# EAGLE schematic Power_Alert (EAGLE 9.6.2)
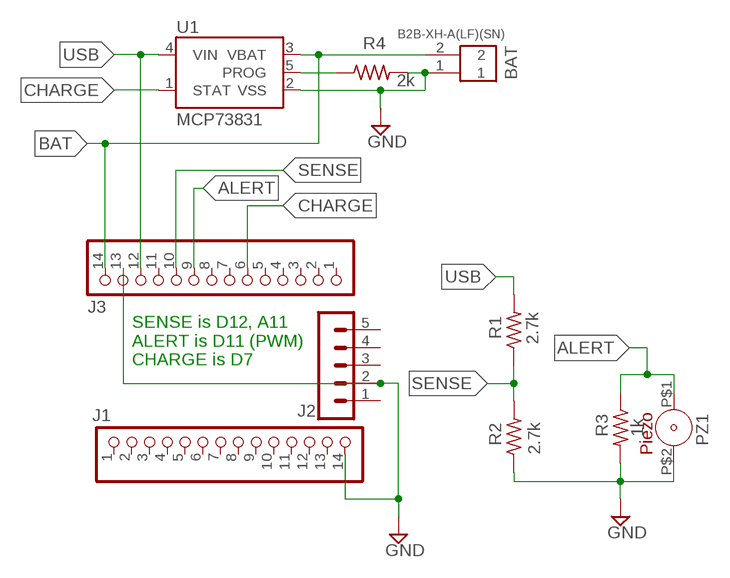
[diagram p0: schematic, sheet 1]

## Parts
BAT  B2B-XH-A(LF)(SN)  [B2B-XH-A(LF)(SN)]
J1  PINHD-1X14  [1X14]
J2  MA05-1  [MA05-1]
J3  PINHD-1X14  [1X14]
PZ1  TDK-PS1420P02CT  [TDK-PS1420P02CT]
R1  2.7k  R-US_R1206  [R1206]
R2  2.7k  R-US_R1206  [R1206]
R3  1k  R-US_R1206  [R1206]
R4  2k  R-US_M1206  [M1206]
U1  MCP73831  [SOT23-5]

## Nets
ALERT: J3.9 PZ1.P$1 R3.1
BAT: BAT.2 J3.14 U1.3(VBAT)
CHARGE: J3.6 U1.1(STAT)
GND: BAT.1 J1.14 J2.2 J3.13 PZ1.P$2 R2.1 R3.2 R4.2 U1.2(VSS)
N$1: R4.1 U1.5(PROG)
SENSE: J3.10 R1.1 R2.2
USB: J3.12 R1.2 U1.4(VIN)
Unconnected: J1.1 J1.2 J1.3 J1.4 J1.5 J1.6 J1.7 J1.8 J1.9 J1.10 J1.11 J1.12 J1.13 J2.1 J2.3 J2.4 J2.5 J3.1 J3.2 J3.3 J3.4 J3.5 J3.7 J3.8 J3.11

## Notes on the sheet
- SENSE is D12, A11
  ALERT is D11 (PWM)
  CHARGE is D7

## Library data of the parts
BAT = jst_fm_headers:B2B-XH-A(LF)(SN): CONN HEADER VERT 4POS 2.5MM Manufacturer's datasheet <http://www.jst-mfg.com/product/pdf/eng/eXH.pdf>; CREATED_BY: PCBLayout.com; DIGIKEY_PARTNO: 455-2249-ND; MANUFACTURER: JST Sales America Inc.; MPN: B4B-XH-A(LF)(SN)
J1 J3 = adafruit:PINHD-1X14: PIN HEADER
J2 = con-lstb:MA05-1: PIN HEADER; OC_FARNELL: unknown; OC_NEWARK: unknown
PZ1 = home:TDK-PS1420P02CT
R1-R4 = adafruit:R-US_: RESISTOR, American symbol
U1 = SparkFun-IC-Power:MCP73831: MCP73831T Li-Ion, Li-Pol Controller Miniature single cell, fully integrated Li-Ion, Li-polymer charge management controller Datasheet <http://ww1.microchip.com/downloads/en/DeviceDoc/20001984g.pdf> SparkFun Products: SparkFun ESP32 Thing <https://www.sparkfun.com/products/13907> SparkFun 9DoF Razor IMU M0 <https://www.sparkfun.com/products/14001>; PROD_ID: IC-09995